# Altium schematic sheet isoSPI.SchDoc
size A4; CompanyName: Technische Hochschule Nürnberg Georg Simon Ohm; Organization: UltraZohm; Address1: Kesslerplatz 12; Address2: 90489 Nürnberg; Address3: GERMANY; SheetNumber: 17; SheetTotal: 36; Website: www.ultrazohm.com
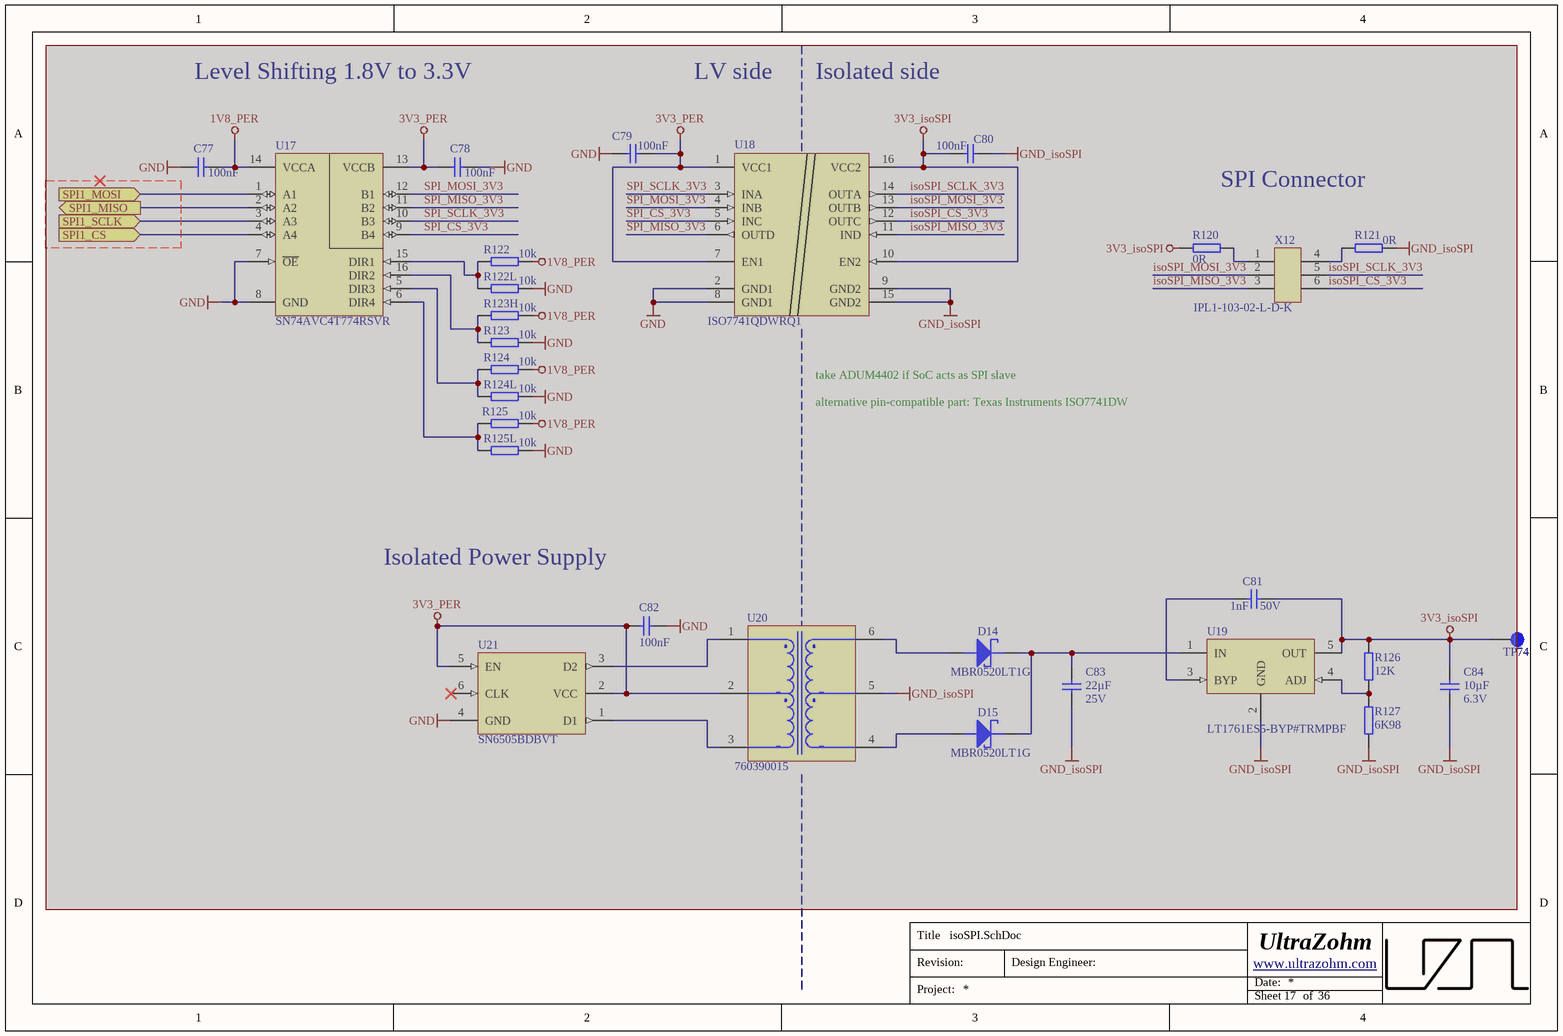
[diagram p0: isoSPI.SchDoc]

## Parts
C77  100nF  [CAPC1608X90N_V]  (masked out: inside a compile mask, not in the netlist)
C78  100nF  [CAPC1608X90N_V]  (masked out: inside a compile mask, not in the netlist)
C79  100nF  [CAPC1608X90N_V]  (masked out: inside a compile mask, not in the netlist)
C80  100nF  [CAPC1608X90N_V]  (masked out: inside a compile mask, not in the netlist)
C81  1nF  Voltage: 50V  [CAPC1608X90N_V]  (masked out: inside a compile mask, not in the netlist)
C82  100nF  [CAPC1608X90N_V]  (masked out: inside a compile mask, not in the netlist)
C83  22µF  Voltage: 25V  [CAPC2012X135N_V]  (masked out: inside a compile mask, not in the netlist)
C84  10µF  Voltage: 6.3V  [CAPC1608X90N_V]  (masked out: inside a compile mask, not in the netlist)
D14  MBR0520LT1G  [SOD3816X120N]  (masked out: inside a compile mask, not in the netlist)
D15  MBR0520LT1G  [SOD3816X120N]  (masked out: inside a compile mask, not in the netlist)
R120  0R  [R_0603_TE]  (masked out: inside a compile mask, not in the netlist)
R121  0R  [R_0603_TE]  (masked out: inside a compile mask, not in the netlist)
R122  10k  [R_0603_TE]  (masked out: inside a compile mask, not in the netlist)
R122L  10k  [R_0603_TE]  (masked out: inside a compile mask, not in the netlist)
R123  10k  [R_0603_TE]  (masked out: inside a compile mask, not in the netlist)
R123H  10k  [R_0603_TE]  (masked out: inside a compile mask, not in the netlist)
R124  10k  [R_0603_TE]  (masked out: inside a compile mask, not in the netlist)
R124L  10k  [R_0603_TE]  (masked out: inside a compile mask, not in the netlist)
R125  10k  [R_0603_TE]  (masked out: inside a compile mask, not in the netlist)
R125L  10k  [R_0603_TE]  (masked out: inside a compile mask, not in the netlist)
R126  12K  [RESC1608X55N_V]  (masked out: inside a compile mask, not in the netlist)
R127  6K98  [RESC1608X55N_V]  (masked out: inside a compile mask, not in the netlist)
TP74  Testpoint 1mm  [TP_1mm]  (value not drawn)  (masked out: inside a compile mask, not in the netlist)
U17  SN74AVC4T774RSVR  [QFN40P260X180X55-16N]  (masked out: inside a compile mask, not in the netlist)
U18  ISO7741QDWRQ1  [SOIC127P1030X265-16N]  (masked out: inside a compile mask, not in the netlist)
U19  LT1761ES5-BYP#TRMPBF  [SOT23-5_N]  (masked out: inside a compile mask, not in the netlist)
U20  760390015  [760390015]  (masked out: inside a compile mask, not in the netlist)
U21  SN6505BDBVT  [SOT95P280X145-6N]  (masked out: inside a compile mask, not in the netlist)
X12  IPL1-103-02-L-D-K  [IPL1-103-02-L-D-K]  (masked out: inside a compile mask, not in the netlist)

## Ports
SPI1_CS (in), SPI1_MISO (out), SPI1_MOSI (in), SPI1_SCLK (in)

## Notes on the sheet
- Level Shifting 1.8V to 3.3V
- LV side
- Isolated side
- SPI Connector
- take ADUM4402 if SoC acts as SPI slave
- alternative pin-compatible part: Texas Instruments ISO7741DW
- Isolated Power Supply
- Title
- Revision:
- Design Engineer:
- Date:
- Project:
- Sheet
- of

## Library data of the parts
C77-C80 C82 = 21382: KON 100nF 50V X7R ±10% SMD BF 1608 (0603); Value: 100n; AN: 21382; Mixed: SMT; Preferred: Yes; Temperature-Range: -55/+125; Tolerance: ±10%; Voltage: 50V; Technology: X7R; Case: 1608 (0603)
C81 = 22523: KON 1nF 50V NP0 5% SMD BF 1608 (0603); Value: 1n; AN: 22523; Mixed: SMT; Technology: NP0; Case: 1608 (0603)
C83 = 29556: KON 22µF 25V  X5R 20% SMD BF 2012 (0805); Value: 22u; AN: 29556; Mixed: SMT; Temperature-Range: -55/+85; Technology: X5R; Case: 2012 (0805); Tolerance: 20%
C84 = 22918: KON 10µF 6,3V X5R SMD BF 1608 (0603); Value: 10u; AN: 22918; Mixed: SMT; Temperature-Range: -55/+85; Technology: X5R; Case: 1608 (0603)
D14 D15 = 26768: Schottky Diode 0.5A 20V SOD-123; AN: 26768; Mixed: SMT; Extra: AEC−Q101; Value: 20V; Case: SOD123-FC; Voltage: 0.5A; HelpURL: B:\AD\adlib\datasheet\MBR0520; H-ART: MBR0520LT1G
R120 R121 = UZgen_R_0603_0R: Generic resistor; Manufacturer: UZgen; Tolerance: 1 %; Created from: UZgenTool; Value: 0R; Manufacturer Part Number: UZgen_R_0603_0R; PartID: 581; Created On: 08.07.2024 14:34:30; Device Package: 0603; Mounting Type: SMD; Last Updated: 08.07.2024 14:34:30
R122 R122L R123 R123H R124 R124L R125 R125L = UZgen_R_0603_10k: Generic resistor; Manufacturer: UZgen; Tolerance: 1 %; Created from: AGeiger; Value: 10k; Manufacturer Part Number: UZgen_R_0603_10k; PartID: 1; Created On: 02.07.2024 14:34:53; Device Package: 0603; Mounting Type: SMD; Last Updated: 02.07.2024 14:37:16
R126 = 22655: WID SMD 12K 1% 0,1W; AN: 22655; Mixed: SMT; Extra: BF 1608 (0603); Tolerance: 1%; Case: 1608 (0603); Technology: TK100; Value: 12K
R127 = 26473: WID SMD 6K98 1% 0,1W  BF 1608 (0603); AN: 26473; Mixed: SMT; Value: 6.98k; Preferred: Yes; Tolerance: 1%; Case: 1608 (0603); Technology: TK100
TP74 = 25063: AN: 25063; Mixed: SMT
U17 = 27170: AN: 27170; Mixed: SMT; Trenz-Stock: Yes; Extra: 4-Bit Dual-Supply Bus Transceiver With Configurable Voltage Translationand 3-Sta; HelpURL: B:\ad\adlib\datasheet\sn74avc4t774; Case: UQFN-16; H-ART: SN74AVC4T774RSVR
U18 = 30781: AN: 30781; Mixed: SMT; Temperature-Range: -40/+125; Extra: General Purpose Digital Isolator 5000Vrms 4 Channel 100Mbps 3/1 16-SOIC; Case: SOIC16; HelpURL: b:\AD\adlib\datasheet\TI\ISO774x\; H-ART: ISO7741QDWRQ1; Storage-Temperature: -65/+150(Abs)
U19 = LT1761ES5-BYP#TRMPBF: 100mA, Low Noise, LDO Micropower Regulators; belongs to SN74AVC4T774RSVR; Manufacturer: Linear Technology; Created from: MGremer; Manufacturer Part Number: LT1761ES5-BYP#TRMPBF; PartID: 5; Created On: 30.11.2020 13:55:34; ComponentLink1Description: Datasheet; ComponentLink1URL: https://www.analog.com/media/en/technical-documentation/data-sheets/1761sff.pdf; Component Type: LDO Micropower; Device Package: TSOT-23; Last Updated: 15.02.2021 10:27:30; Mounting Type: SMD; Supplier 1: Farnell; Supplier Part Number 1: 1663782; Type: LDO Micropower Regulator; Live Cycle Status: 1; Stock number: not stored
U20 = 30767: AN: 30767; Mixed: SMT; Temperature-Range: -40/+125; Extra: Push-Pull Transformer 1:2 0.35A; Case: MID-PPTI; HelpURL: b:\AD\adlib\datasheet\Wuerth\MID-PPTI\760390015\; H-ART: 760390015
U21 = 30768: AN: 30768; Mixed: SMT; Temperature-Range: -55/+125; Extra: 1-A Transformer Driver for Isolated Power Supplies SOT23-6; Case: SOT23-6; HelpURL: b:\AD\adlib\datasheet\TI\SN6505x\; H-ART: SN6505BDBVT; Storage-Temperature: -65/+150 (Abs)
X12 = 30760: AN: 30760; Mixed: SMT; H-ART: IPL1-103-02-L-D-K-TR; Temperature-Range: -55/+125; Extra: Connector Header IPL1, 2-row 6pos, key polarization, SMT 0°; Case: IPL1; HelpURL: b:\AD\adlib\datasheet\Samtec\IPL1-SMT\